# Altium project Auto Plant Controller - ESP WROOM - 3.PrjPcb
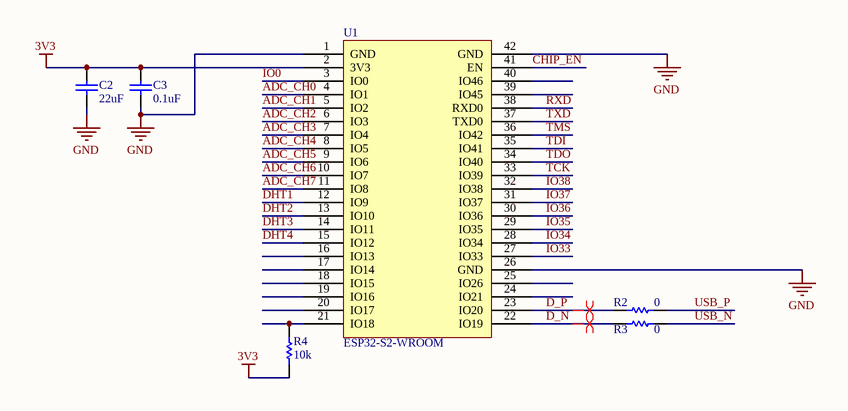
[diagram p0: ESP32.SchDoc]
3 sheets, 33 parts. Net scope: global (net labels, ports and power ports of the same name join across sheets).
Sheets:
  ESP32.SchDoc
  VREG.SchDoc
  Connectors.SchDoc

## Sheet ESP32.SchDoc
size A

### Parts
C2  22uF  [C0805]
C3  0.1uF  [0402C]
R2  0  [PCB-azzhouwj1h0sqqpj65ny-1]
R3  0  [PCB-azzhouwj1h0sqqpj65ny-1]
R4  10k  [PCB-urbe6pl2f36u5sj9z9e0-1]
U1  ESP32-S2-WROOM  [PCBComponent_1]

### Nets
3V3: C2.2 C3.1 R4.2 U1.2(3V3)
GND: C2.1 C3.2 U1.1(GND) U1.26(GND) U1.42(GND)
ADC_CH0: U1.4(IO1)
ADC_CH1: U1.5(IO2)
ADC_CH2: U1.6(IO3)
ADC_CH3: U1.7(IO4)
ADC_CH4: U1.8(IO5)
ADC_CH5: U1.9(IO6)
ADC_CH6: U1.10(IO7)
ADC_CH7: U1.11(IO8)
CHIP_EN: U1.41(EN)
D_N: R3.1 U1.22(IO19)
D_P: R2.1 U1.23(IO20)
DHT1: U1.12(IO9)
DHT2: U1.13(IO10)
DHT3: U1.14(IO11)
DHT4: U1.15(IO12)
IO0: U1.3(IO0)
IO33: U1.27(IO33)
IO34: U1.28(IO34)
IO35: U1.29(IO35)
IO36: U1.30(IO36)
IO37: U1.31(IO37)
IO38: U1.32(IO38)
RXD: U1.38(RXD0)
TCK: U1.33(IO39)
TDI: U1.35(IO41)
TDO: U1.34(IO40)
TMS: U1.36(IO42)
TXD: U1.37(TXD0)
USB_N: R3.2
USB_P: R2.2
NetR4_1: R4.1 U1.21(IO18)

Not connected (* = marked no-connect by the designer): U1 16(IO13) 17(IO14) 18(IO15) 19(IO16) 20(IO17) 24(IO21) 25(IO26) 39(IO45) 40(IO46)

### Layout directives
differential pair: D_N, D_P

### Library data of the parts
C2 = CMP-3afbf396deb1e53c-2: LMK212BJ226MG-T TAIYO YU DEN CERAMIC CAPACITOR 22U F 20% 10V X5R 0805 RoHS; Voltage Rating (DC): 10.0 V; Lifecycle Status: Not Listed by Manufacturer; Number of Pins: 2; Case/Package: 0805, 2012; Mounting Style: Surface Mount; Octopart URL: http://octopart.com/lmk212bj226mg-t-taiyo+yuden-6799660; OctopartID: 3afbf396deb1e53c; Capacitance Tolerance: ±20%; Dielectric Characteristic: X5R
C3 = CMP-19299680-6: 0402 0.1 uF 10 V ±10 % Tolerance X5R Surface Mount Multilayer Ceramic Capacitor; Manufacturer Part Number: GRM155R61A104KA01D; Voltage Rating (DC): 10.0 V; Lead-Free Status: Lead Free; Capacitance Tolerance: ±10%; Capacitance: 100 nF; Dielectric Characteristic: X5R; Number of Pins: 2; Size-Length: 1.00 mm; RoHS: Compliant; Size-Height: 500 µm; Octopart Url: http://octopart.com/grm155r61a104ka01d-murata-196036; Seller Landing  Url: https://octopart-clicks.com/click/track?country=US&ak=8157f166&sig=0ce8b58&sid=1106&ppid=196036&vpid=21326200&ct=offers; Case/Package: 0402; Size-Thickness: 500 µm; OctopartID: 87004e085fa258c7; Lifecycle Status: Active; REACH SVHC Compliance: No SVHC; Size-Width: 500 µm; Packaging: Cut Tape (CT); Mounting Style: Surface Mount
R2 R3 = CMP-13527731-11: RC Series 0402 0.063 W 0 Ohms Jumper Surface Mount Thick Film Chip Resistor; Temperature Coefficient: -250 ppm/°C to 250 ppm/°C; RoHS: Compliant; Packaging: Tape & Reel; Number of Pins: 2; Size-Width: 500 µm; OctopartID: 3abff0f8c341e578
R4 = CMP-1974d512ef63c6b3-1: Res, AEC-Q200, Thick Film, 10K, 5%, 0603; Manufacturer Part Number: CRGCQ0603J10K; Packaging: Cut Tape (CT); Resistance Tolerance: ±5%; Lifecycle Status: Not Listed by Manufacturer; OctopartID: 1974d512ef63c6b3; Octopart URL: https://octopart.com/crgcq0603j10k-te+connectivity-91018097
U1 = CMP-dacd15a1cbe3050a-2: SMD Module ESP32-S2-WROOM; Octopart URL: https://octopart.com/esp32-s2-wroom-espressif+systems-107361352

## Sheet VREG.SchDoc
size A
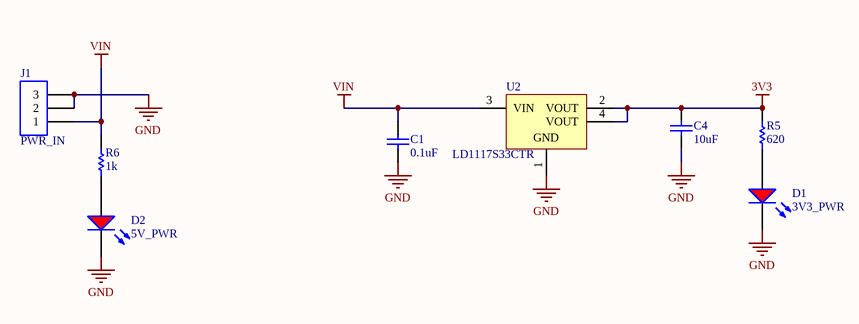
[diagram p1: VREG.SchDoc]

### Parts
C1  0.1uF  [PCB-5bhg8adqnzhgtf4b63gj-1]
C4  10uF  [PCB-19299738-1]
D1  3V3_PWR  [KING-LED0603-25-RED_V]
D2  5V_PWR  [KING-LED0603-25-RED_V]
J1  PWR_IN  [ADAM-ADC-002-3_V]
R5  620  [RESC1005X40X25NL05T05]
R6  1k  [RESC1005X40X25NL05T05]
U2  LD1117S33CTR  [SOT-223_N]

### Nets
3V3: C4.2 R5.2 U2.2(VOUT) U2.4(VOUT)
GND: C1.1 C4.1 D1.2(C) D2.2(C) J1.2 J1.3 U2.1(GND)
VIN: C1.2 J1.1 R6.2 U2.3(VIN)
NetD1_1: D1.1(A) R5.1
NetD2_1: D2.1(A) R6.1

### Library data of the parts
C1 = CMP-76b0bfb95be4a977-1: 0402 0.1 uF 25 V ±10% Tolerance X5R SMT Multilayer Ceramic Capacitor; Manufacturer Part Number: TMK105BJ104KV-F; Lead-Free Status: Lead Free; Capacitance: 100 nF; Voltage Rating (DC): 25.0 V; Size-Length: 1.00 mm; Octopart URL: https://octopart.com/tmk105bj104kv-f-taiyo+yuden-198706; OctopartID: 76b0bfb95be4a977; RoHS: Compliant; Size-Height: 500 µm; REACH SVHC Compliance: No SVHC; Capacitance Tolerance: ±10%; Dielectric Characteristic: X5R; Packaging: Cut Tape (CT), Tape & Reel (TR); Operating Temperature: -55.0 °C to 85.0 °C; Case/Package: 0402; Mounting Style: Surface Mount; Size-Width: 500 µm; Halogen Free Status: Halogen Free; Lifecycle Status: Active; Number of Pins: 2
C4 = CMP-19299738-2: CAP CER 10UF 10V 10% X5R 0805; Manufacturer Part Number: GRM21BR61A106KE19L; Capacitance: 1e-05 F; Case/Package (SI): 2012; Lead-Free Status: Lead Free; Voltage Rating (DC): 10.0 V; Capacitance Tolerance: ±10%; Dielectric Characteristic: X5R; Lifecycle Status: Active; Mounting Style: Surface Mount; Number of Pins: 2; Octopart Url: https://octopart.com/grm21br61a106ke19l-murata-196422; OctopartID: ff26362e250620e1; Packaging: Cut Tape (CT); REACH SVHC Compliance: No SVHC; RoHS: Compliant; Size-Height: 0.00125 m; Size-Length: 0.002 m; Size-Thickness: 0.00125 m; Size-Width: 0.00125 m
D1 D2 = CMP-20cce8f01131ff0b-3: 1.6 x 0.8 x 0.4 mm (0603) Red 120º Min 11.5mcd Max 28.5mcd SMT LED; Manufacturer Part Number: 19-217/R6C-AL1M2VY/3T; RoHS: Compliant; OctopartID: 20cce8f01131ff0b; Seller Landing  Url: https://octopart-clicks.com/click/track?country=US&ak=8157f166&sig=0e63595&sid=2454&ppid=20321435&vpid=57003316&ct=offers
J1 = CMP-3153101-9: DC Power Connectors DC POWER JACK 2.5MM PIN TYPE 002; Manufacturer Part Number: ADC-002-2; Octopart Url: https://octopart.com/adc-002-2-adam+tech-55509430; OctopartID: 975d5d18b38d489a; Orientation: Right Angle
R5 = CMP-3676372-2: Thick Film Resistors - SMD 0402 620ohms 5% Tol; Manufacturer Part Number: ERJ-2GEJ621X; Lead-Free Status: Lead Free; Power Rating: 0.1 W; Resistance: 620.0 Ω; Voltage Rating (DC): 50.0 V; Case/Package: 0402; Lifecycle Status: Not Listed by Manufacturer; Mounting Style: Surface Mount; Octopart Url: https://octopart.com/erj-2gej621x-panasonic-55420795; OctopartID: 363cfc7bb421e9fb; Packaging: Cut Tape (CT); REACH SVHC Compliance: No SVHC; Resistance Tolerance: ±5%; RoHS: Compliant; Size-Height: 0.00035 m; Size-Length: 0.001 m; Size-Width: 0.0005 m
R6 = CMP-1903935-2: RES SMD 1K OHM 5% 1/16W 0402; Manufacturer Part Number: CRCW04021K00JNTD; Lead-Free Status: Contains Lead; Power Rating: 0.063 W; Resistance: 1000.0 Ω; Voltage Rating (DC): 50.0 V; Case/Package: 0402; Mounting Style: Surface Mount; Number of Pins: 2; Octopart Url: https://octopart.com/crcw04021k00jntd-vishay+dale-39408639; OctopartID: 1db5d6e66b2cc272; Resistance Tolerance: ±5%; RoHS: Non-Compliant; Size-Height: 0.00035 m; Size-Length: 0.001 m; Size-Width: 0.0005 m
U2 = CMP-1170392-2: Fixed Low Drop Positive Voltage Regulator, 3.3V, 4-Pin SOT-223, Tape and Reel; Dropout Voltage: 1.1 V; Lead-Free Status: Lead Free; Number of Outputs: 1; Case/Package: SOT-223; Lifecycle Status: Active; Mounting Style: Surface Mount; Number of Pins: 3; Octopart Url: https://octopart.com/ld1117s33ctr-stmicroelectronics-526725; OctopartID: 0754ce562bb7d893; Output Voltage: 3.3 V; REACH SVHC Compliance: No SVHC; RoHS: Compliant; Manufacturer Part Number: LD1117S33CTR

## Sheet Connectors.SchDoc
size A
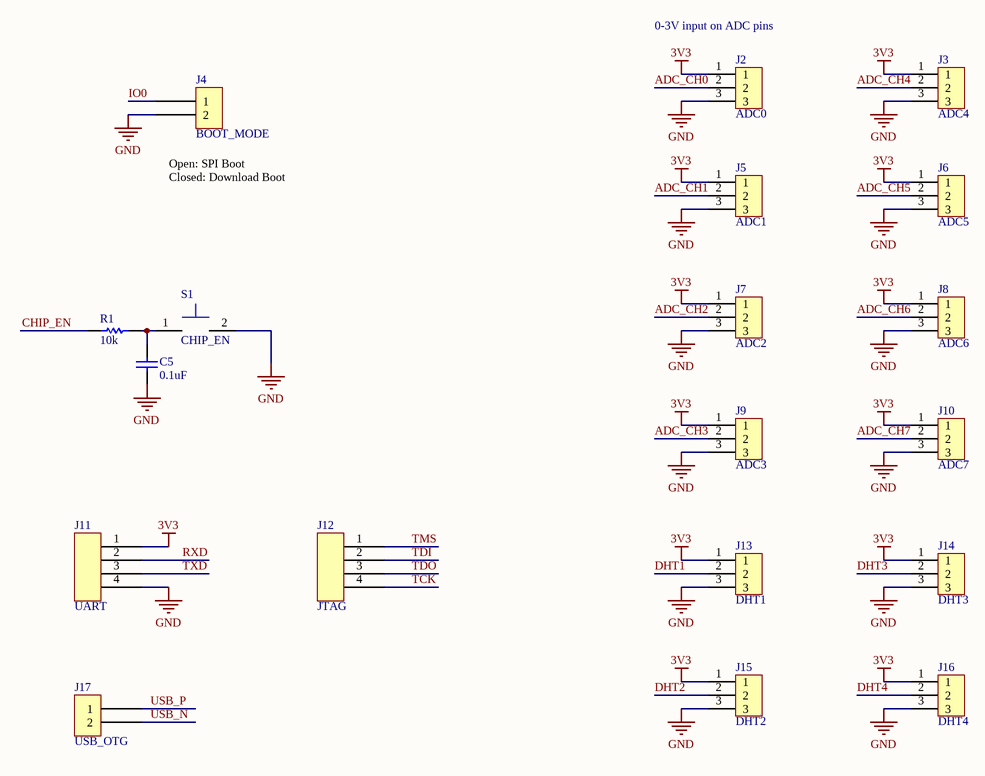
[diagram p2: Connectors.SchDoc]

### Parts
C5  0.1uF  [PCB-oygqt4xf3sesynjclq4r-1]
J2  ADC0  [PCB-xi9jnxfk0tsn3lp09zze-1]
J3  ADC4  [PCB-xi9jnxfk0tsn3lp09zze-1]
J4  BOOT_MODE  [Jumper]
J5  ADC1  [PCB-xi9jnxfk0tsn3lp09zze-1]
J6  ADC5  [PCB-xi9jnxfk0tsn3lp09zze-1]
J7  ADC2  [PCB-xi9jnxfk0tsn3lp09zze-1]
J8  ADC6  [PCB-xi9jnxfk0tsn3lp09zze-1]
J9  ADC3  [PCB-xi9jnxfk0tsn3lp09zze-1]
J10  ADC7  [PCB-xi9jnxfk0tsn3lp09zze-1]
J11  UART  [PCB-w7fgx0p37qyww1etoafk-1]
J12  JTAG  [PCB-w7fgx0p37qyww1etoafk-1]
J13  DHT1  [PCB-xi9jnxfk0tsn3lp09zze-1]
J14  DHT3  [PCB-xi9jnxfk0tsn3lp09zze-1]
J15  DHT2  [PCB-xi9jnxfk0tsn3lp09zze-1]
J16  DHT4  [PCB-xi9jnxfk0tsn3lp09zze-1]
J17  USB_OTG  [Jumper]
R1  10k  [PCB-urbe6pl2f36u5sj9z9e0-1]
S1  CHIP_EN  [PCB-xzcf6rj7v3ysitq80b7l-1]

### Nets
3V3: J2.1 J3.1 J5.1 J6.1 J7.1 J8.1 J9.1 J10.1 J11.1 J13.1 J14.1 J15.1 J16.1
GND: C5.1 J2.3 J3.3 J4.2 J5.3 J6.3 J7.3 J8.3 J9.3 J10.3 J11.4 J13.3 J14.3 J15.3 J16.3 S1.2
ADC_CH0: J2.2
ADC_CH1: J5.2
ADC_CH2: J7.2
ADC_CH3: J9.2
ADC_CH4: J3.2
ADC_CH5: J6.2
ADC_CH6: J8.2
ADC_CH7: J10.2
CHIP_EN: R1.2
DHT1: J13.2
DHT2: J15.2
DHT3: J14.2
DHT4: J16.2
IO0: J4.1
RXD: J11.2
TCK: J12.4
TDI: J12.2
TDO: J12.3
TMS: J12.1
TXD: J11.3
USB_N: J17.2
USB_P: J17.1
NetC5_2: C5.2 R1.1 S1.1

### Notes on the sheet
- (near J2) 0-3V input on ADC pins
- (near J4) Open: SPI Boot
  Closed: Download Boot

### Library data of the parts
C5 = CMP-2758844-5: 0.1uF, ±10%, 50V, X7R, 0805, Multilayer Ceramic Capacitor; Manufacturer Part Number: CL21B104KBCNNNC; Lead-Free Status: Lead Free; Voltage Rating (DC): 50.0 V; Capacitance: 100 nF; Operating Temperature: -55.0 °C (min); RoHS: Compliant; Octopart URL: https://octopart.com/cl21b104kbcnnnc-samsung-9299352; Mounting Style: Surface Mount; Case/Package: 0805; Dielectric Characteristic: X7R; OctopartID: 94265da154d84be1
J2 J3 J5-J10 J13-J16 = CMP-5821934eb82787e6-1: Conn Unshrouded Header HDR 3 POS 2.54mm Solder ST Thru-Hole; Manufacturer Part Number: 4-103321-5; ELV Compliant: Compliant; Mounting Style: PCB; RoHS: Compliant; Housing Color: Black; OctopartID: 5821934eb82787e6; Flammability Rating: UL 94 V-0; Contact Material: Phosphor Bronze; Octopart URL: http://octopart.com/4-103321-5-te+connectivity+%2F+amp-40224096; Contact Plating: Tin, Tin over Nickel; Housing Material: Thermoplastic; Lifecycle Status: Active; Orientation: Vertical
J4 J17 = CMP-08fac3900112d73d-14: 2 pin male header straight tht; Number of Positions: 2; Contact Plating: Gold; Mounting Style: Through Hole, Solder; Material: Thermoplastic
J11 J12 = CMP-4df18464dcf59236-2: Conn Unshrouded Header HDR 4 POS 2.54mm Solder ST Thru-Hole KK?? Bag; Manufacturer Part Number: 0022032041; RoHS: Compliant; Lifecycle Status: Not Listed by Manufacturer; Octopart URL: http://octopart.com/0022032041-molex-10466402; OctopartID: 4df18464dcf59236
R1 = CMP-1974d512ef63c6b3-1: as R4 on sheet ESP32; Packaging: Cut Tape (CT); Resistance Tolerance: ±5%; Lifecycle Status: Not Listed by Manufacturer; OctopartID: 1974d512ef63c6b3; Octopart URL: https://octopart.com/crgcq0603j10k-te+connectivity-91018097
S1 = CMP-32abff024869ed6c-2: Switch Tactile Spst-No 0.02a 15v

## Nets that join several sheets
3V3: ESP32 (C2.2 C3.1 R4.2 U1.2), VREG (C4.2 R5.2 U2.2 U2.4), Connectors (13 pins)
GND: ESP32 (5 pins), VREG (7 pins), Connectors (16 pins)
ADC_CH0: ESP32 (U1.4), Connectors (J2.2)
ADC_CH1: ESP32 (U1.5), Connectors (J5.2)
ADC_CH2: ESP32 (U1.6), Connectors (J7.2)
ADC_CH3: ESP32 (U1.7), Connectors (J9.2)
ADC_CH4: ESP32 (U1.8), Connectors (J3.2)
ADC_CH5: ESP32 (U1.9), Connectors (J6.2)
ADC_CH6: ESP32 (U1.10), Connectors (J8.2)
ADC_CH7: ESP32 (U1.11), Connectors (J10.2)
CHIP_EN: ESP32 (U1.41), Connectors (R1.2)
DHT1: ESP32 (U1.12), Connectors (J13.2)
DHT2: ESP32 (U1.13), Connectors (J15.2)
DHT3: ESP32 (U1.14), Connectors (J14.2)
DHT4: ESP32 (U1.15), Connectors (J16.2)
IO0: ESP32 (U1.3), Connectors (J4.1)
RXD: ESP32 (U1.38), Connectors (J11.2)
TCK: ESP32 (U1.33), Connectors (J12.4)
TDI: ESP32 (U1.35), Connectors (J12.2)
TDO: ESP32 (U1.34), Connectors (J12.3)
TMS: ESP32 (U1.36), Connectors (J12.1)
TXD: ESP32 (U1.37), Connectors (J11.3)
USB_N: ESP32 (R3.2), Connectors (J17.2)
USB_P: ESP32 (R2.2), Connectors (J17.1)